# Altium project test.PrjPcb
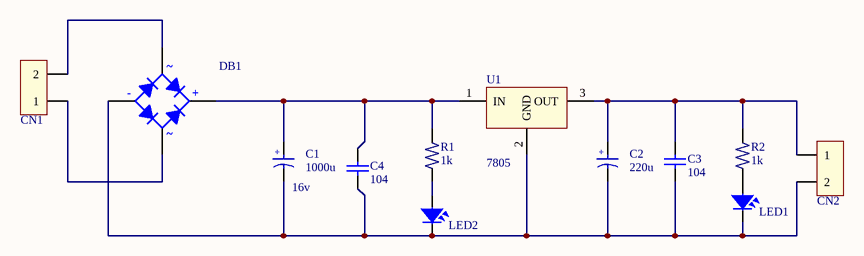
[diagram p0: test_nguyenLy.SchDoc]
1 sheet, 12 parts. Net scope: global (net labels, ports and power ports of the same name join across sheets).
Board files: test_In.PcbDoc, fileXemTrcKhiIn.PcbDoc

## Sheet test_nguyenLy.SchDoc
size A4

### Parts
C1  Volt: 16v  [Cap 10mm]  (hidden comment: 1000u)
C2  220u  [Cap 10mm]
C3  104  [Cap Non Pol 3mm]
C4  104  [Cap Non Pol 3mm]
CN1  Con2/Header2  [Terminal Block2]  (value not drawn)
CN2  Con2/Header2  [Terminal Block2]  (value not drawn)
DB1  Diode bridge  [DIO-Bri 1A]  (value not drawn)
LED1  LED  [LED-5mm BLUE]  (value not drawn)
LED2  LED  [LED-5mm BLUE]  (value not drawn)
R1  1k  [RESISTOR 1/4W]
R2  1k  [RESISTOR 1/4W]
U1  7805  [QTO-220]

### Nets
NetC1_1: C1.1 C4.2 DB1.1(K) R1.2 U1.1(IN)
NetC1_2: C1.2 C2.2 C3.1 C4.1 CN2.2 DB1.4(A) LED1.2 LED2.2 U1.2(GND)
NetC2_1: C2.1 C3.2 CN2.1 R2.2 U1.3(OUT)
NetCN1_1: CN1.1 DB1.3(C)
NetCN1_2: CN1.2 DB1.2(C)
NetLED1_1: LED1.1 R2.1
NetLED2_1: LED2.1 R1.1

### Notes on the sheet
- (in symbol Cap Pol) +
- (in symbol Diode bridge) ~; -; +

### Library data of the parts
C1 = Cap Pol: Value: 1000u
C2 = Cap Pol: Volt: 16v; Value: 220u
C3 C4 = Cap Non Pol: Cap Nol Pol; Volt: 16V; Value: 104
CN1 CN2 = Con2/Header2: CON2
R1 R2 = RESISTOR: Walt: 1/4W; Value: 1k
U1 = 78xx: LM78xx, on ap +